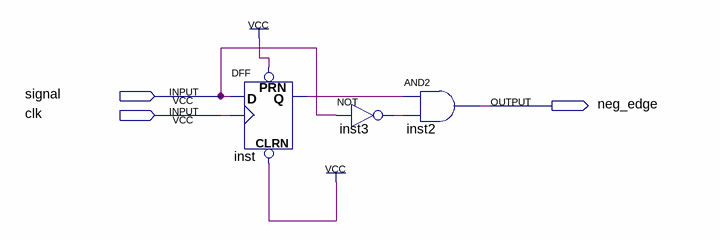
[diagram p0: schematic sheet]
// Quartus schematic edgedetect.bdf as structural Verilog: 3 symbols, 3 pins
module edgedetect (
  input  signal,
  input  clk,
  output neg_edge
);

  wire inst3_out, inst_q;

  DFF inst (.CLRN(1'b1), .CLK(clk), .D(signal), .PRN(1'b1), .Q(inst_q));
  not inst3 (inst3_out, signal);
  and inst2 (neg_edge, inst_q, inst3_out);
endmodule
